# Altium schematic sheet RWM_Filter.SchDoc
size A4; SheetNumber: 7; SheetTotal: 7
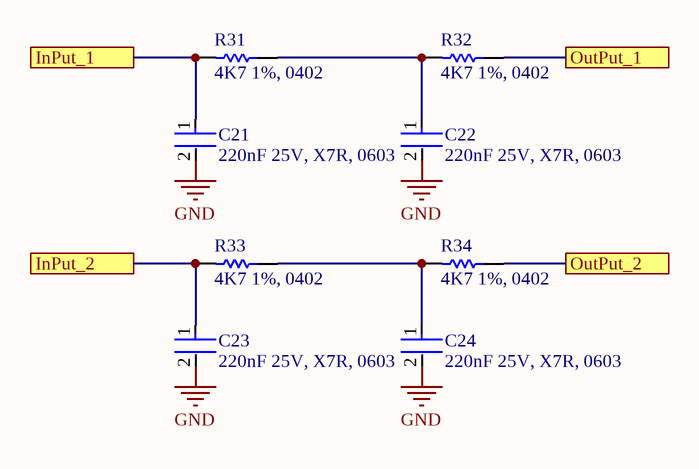
[diagram p0: RWM_Filter.SchDoc]

## Parts
C21  220nF 25V, X7R, 0603  [FP-GCM188-0_1-IPC_B]
C22  220nF 25V, X7R, 0603  [FP-GCM188-0_1-IPC_B]
C23  220nF 25V, X7R, 0603  [FP-GCM188-0_1-IPC_B]
C24  220nF 25V, X7R, 0603  [FP-GCM188-0_1-IPC_B]
R31  4K7 1%, 0402  [RESC1005X40X25LL05T05]
R32  4K7 1%, 0402  [RESC1005X40X25LL05T05]
R33  4K7 1%, 0402  [RESC1005X40X25LL05T05]
R34  4K7 1%, 0402  [RESC1005X40X25LL05T05]

## Ports
InPut_1, InPut_2, OutPut_1, OutPut_2

## Nets
GND: C21.2 C22.2 C23.2 C24.2
InPut_1: C21.1 R31.2 ; port InPut_1
InPut_2: C23.1 R33.2 ; port InPut_2
OutPut_1: R32.1 ; port OutPut_1
OutPut_2: R34.1 ; port OutPut_2
NetC22_1: C22.1 R31.1 R32.2
NetC24_1: C24.1 R33.1 R34.2

## Library data of the parts
C21-C24 = CMP-2006-02366-2: Ceramic Capacitor for Automotive 220nF  ±10% 25VDC X7R 0603 Paper T/R; Capacitance: 220nF; Mount: Surface Mount; Ratings: AEC-Q200; Case/Package: 0603; Packaging: Tape and Reel; Radiation Hardening: No; Voltage: 25V; Dielectric: X7R; Case Code (Imperial): 0603; Max Operating Temperature: 125°C; Min Operating Temperature: -55°C; Depth: 0.8mm; Termination: SMD/SMT; Package Quantity: 1; Case Code (Metric): 1608; Thickness: 0.035inch; Voltage Rating: 25V; Tolerance: 10%; Voltage Rating (DC): 25V; Height: 0.8mm; Lead Free: Lead Free; Length: 1.6mm; Width: 0.031inch
R31-R34 = CMP-2002-01154-4: Chip Resistor, 4.7 KOhm, +/- 1%, 0.1 W, -55 to 155 degC, 0402 (1005 Metric), RoHS, Tape and Reel; PartNumber: ERJ-2RKF4701X; Voltage Rating: 50 V; Case\/Package: 0402; Power Rating: 100 mW; Height: 0.35 mm; Mounting Technology: Surface Mount; REACH SVHC: Yes; Resistance: 4.7 KOhm; Max Operating Temperature: 155 degC; ComponentLink1Description: Manufacturer URL; ComponentLink2Description: Datasheet; Pins: 2; PackageReference: 0402; Tolerance: 1%; Case Code (Imperial): 0402; Length: 1 mm; PackageDescription: 2-Pin Surface Mount Device, Body 1 x 0.5 mm; RoHSCompliant: true; Package Quantity: 1; Radiation Hardening: No; DatasheetVersion: 04/2015; Width: 0.5 mm; Case Code (Metric): 1005; Mount: Surface Mount; ComponentLink1URL: http://www.panasonic.com/; Min Operating Temperature: -55 degC; Packaging: Cut Tape; ComponentLink2URL: http://industrial.panasonic.com/cdbs/www-data/pdf/RDA0000/AOA0000C86.pdf